# Altium schematic sheet AMC_BOX_Panel.SchDoc
size A3 portrait
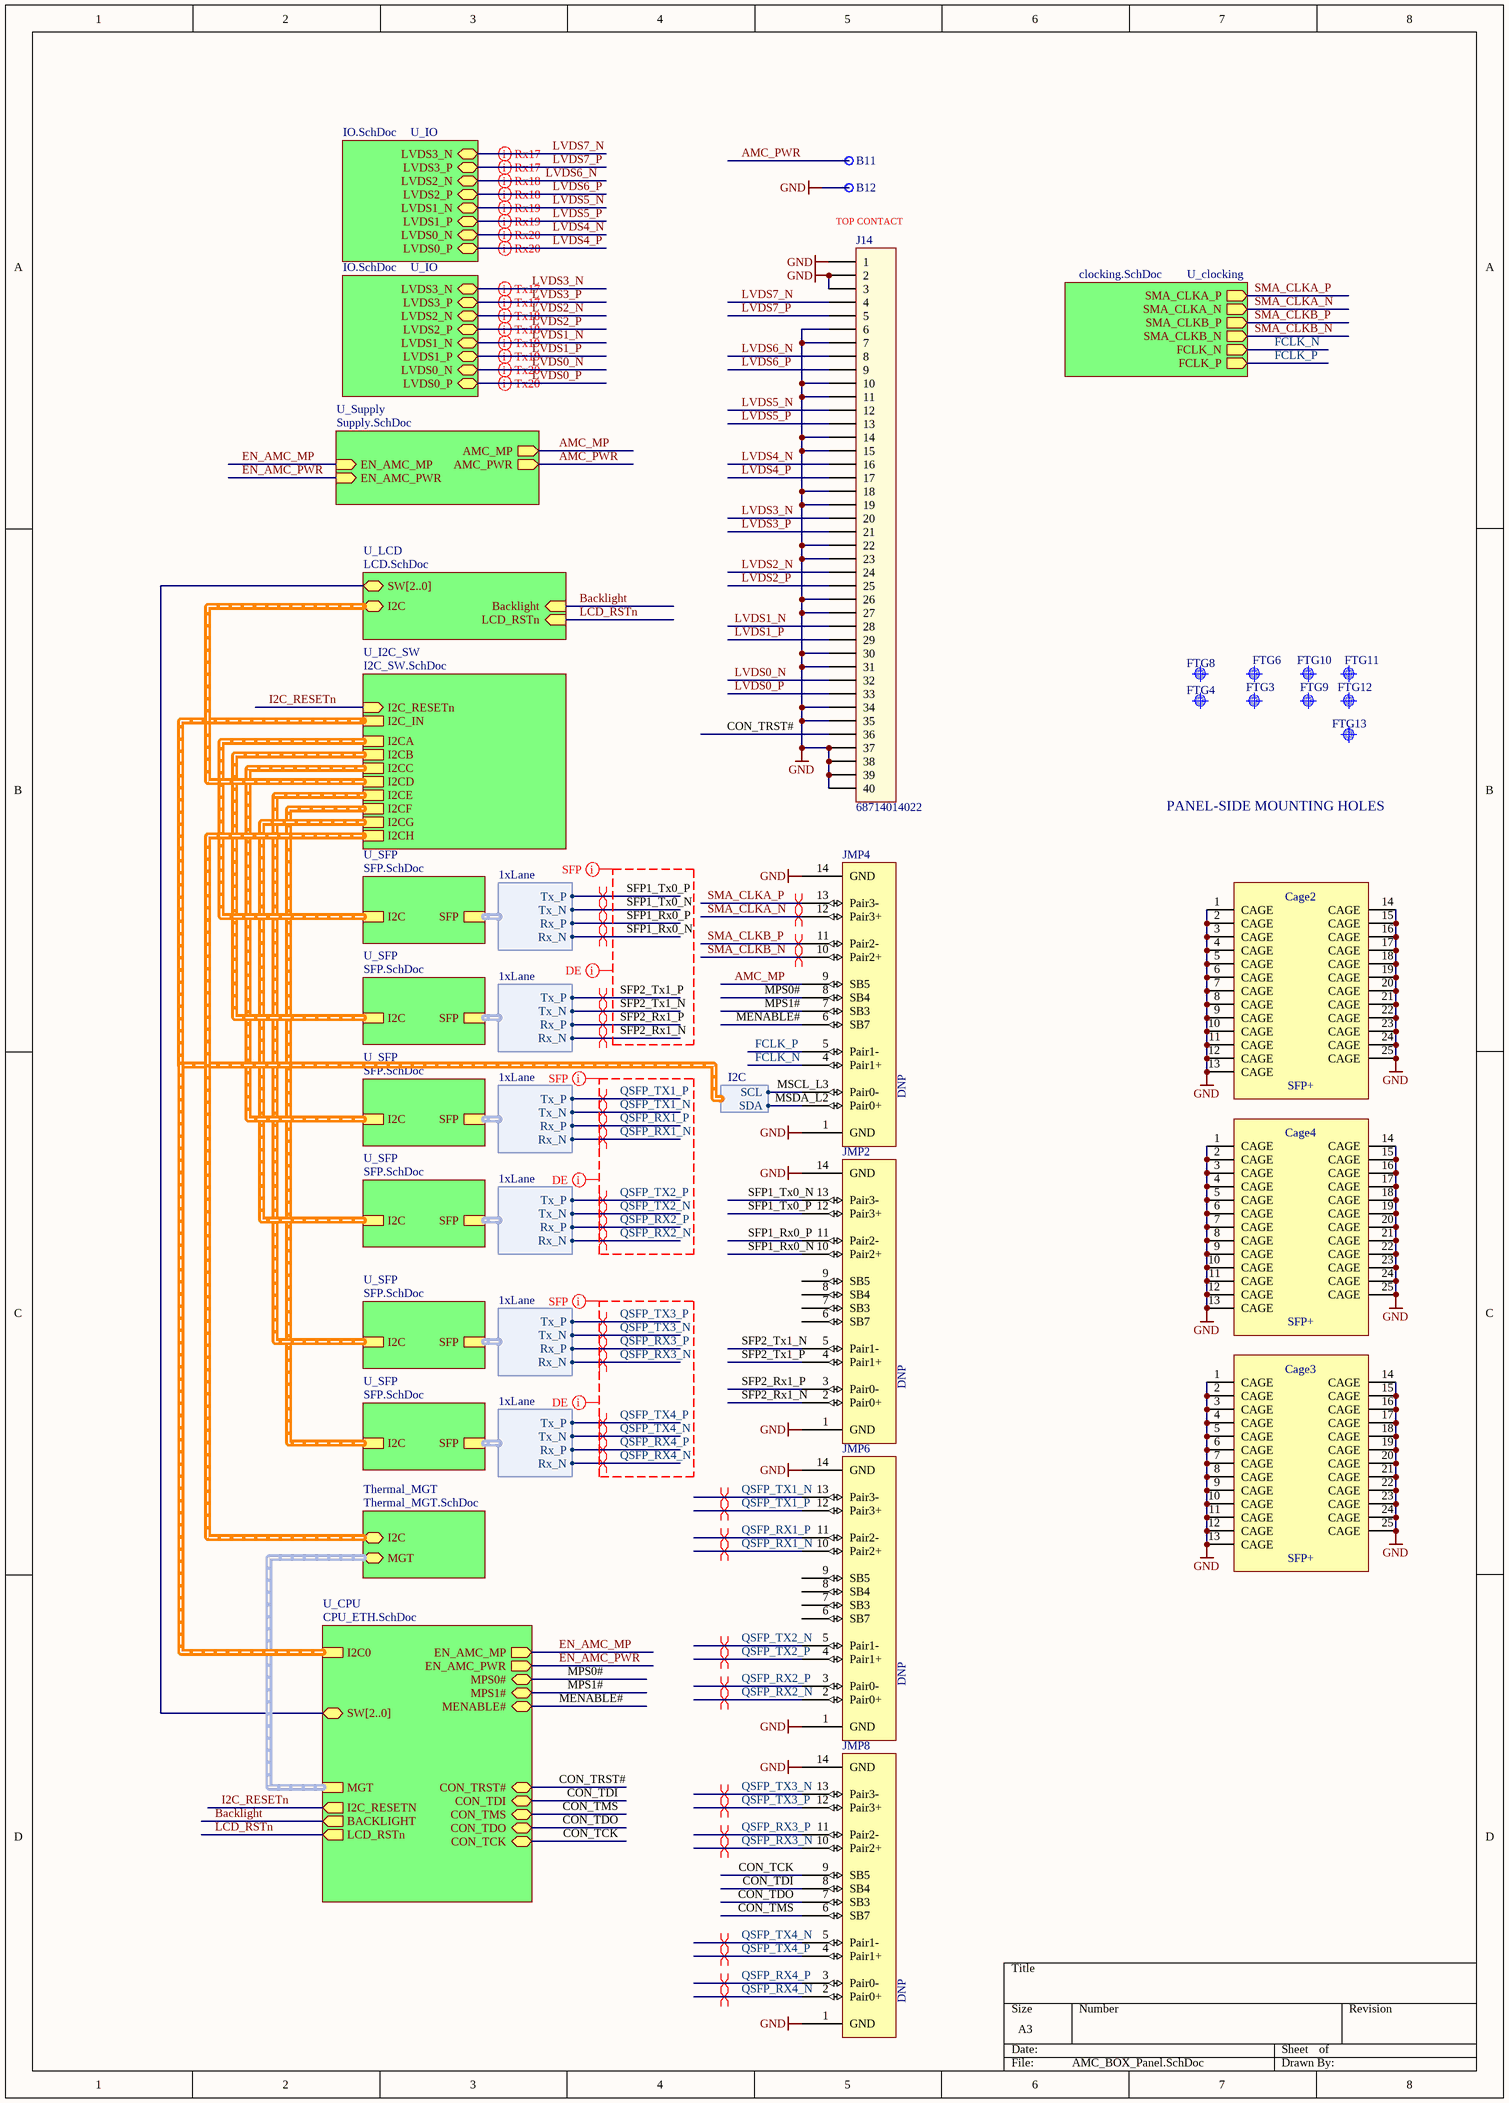
[diagram p0: AMC_BOX_Panel.SchDoc]

## Parts
B11  Plated Hole  [c200h150]  (value not drawn)
B12  Plated Hole  [c200h150]  (value not drawn)
Cage2  SFP+  [TYCO_2007263-1]
Cage3  SFP+  [TYCO_2007263-1]
Cage4  SFP+  [TYCO_2007263-1]
FTG3  Use only in PCB  [FIDUCIAL_TOP_S100-200]  (value not drawn)
FTG4  Use only in PCB  [FIDUCIAL_TOP_S100-200]  (value not drawn)
FTG6  Use only in PCB  [FIDUCIAL_TOP_S100-200]  (value not drawn)
FTG8  Use only in PCB  [FIDUCIAL_TOP_S100-200]  (value not drawn)
FTG9  Use only in PCB  [FIDUCIAL_TOP_S100-200]  (value not drawn)
FTG10  Use only in PCB  [FIDUCIAL_TOP_S100-200]  (value not drawn)
FTG11  Use only in PCB  [FIDUCIAL_TOP_S100-200]  (value not drawn)
FTG12  Use only in PCB  [FIDUCIAL_TOP_S100-200]  (value not drawn)
FTG13  Use only in PCB  [FIDUCIAL_TOP_S100-200]  (value not drawn)
J14  68714014022  [68714014022]
JMP2  DNP  [3M_Twinax_SL8801/12-10DA5-00]
JMP4  DNP  [3M_Twinax_SL8801/12-10DA5-00]
JMP6  DNP  [3M_Twinax_SL8801/12-10DA5-00]
JMP8  DNP  [3M_Twinax_SL8801/12-10DA5-00]

## Sub-sheets
Thermal_MGT = Thermal_MGT.SchDoc: I2C (harness I2C), MGT (harness THERM_MGT)
U_clocking = clocking.SchDoc: SMA_CLKA_P (out), SMA_CLKA_N (out), SMA_CLKB_P (out), SMA_CLKB_N (out), FCLK_N (out), FCLK_P (out)
U_CPU = CPU_ETH.SchDoc: I2C0 (harness I2C), MGT (harness THERM_MGT), EN_AMC_MP (out), EN_AMC_PWR (out), MPS0# (bidir), MPS1# (bidir), MENABLE# (bidir), CON_TRST#, CON_TDI (bidir), CON_TMS (bidir), CON_TDO (bidir), CON_TCK (bidir), SW[2..0] (bidir), BACKLIGHT (out), LCD_RSTn (out), I2C_RESETN (out)
U_I2C_SW = I2C_SW.SchDoc: I2C_RESETn (in), I2CE (harness I2C), I2CB (harness I2C), I2CA (harness I2C), I2CD (harness I2C), I2CC (harness I2C), I2CG (harness I2C), I2CF (harness I2C), I2CH (harness I2C), I2C_IN (harness I2C)
U_IO = IO.SchDoc: LVDS3_N (bidir), LVDS3_P (bidir), LVDS2_N (bidir), LVDS2_P (bidir), LVDS1_N (bidir), LVDS1_P (bidir), LVDS0_N (bidir), LVDS0_P (bidir)
U_IO = IO.SchDoc: LVDS3_N (bidir), LVDS3_P (bidir), LVDS2_N (bidir), LVDS2_P (bidir), LVDS1_N (bidir), LVDS1_P (bidir), LVDS0_N (bidir), LVDS0_P (bidir)
U_LCD = LCD.SchDoc: I2C, Backlight (in), LCD_RSTn (in), SW[2..0] (bidir)
U_SFP = SFP.SchDoc: I2C (harness I2C), SFP (harness 1xLane)
U_SFP = SFP.SchDoc: I2C (harness I2C), SFP (harness 1xLane)
U_SFP = SFP.SchDoc: I2C (harness I2C), SFP (harness 1xLane)
U_SFP = SFP.SchDoc: I2C (harness I2C), SFP (harness 1xLane)
U_SFP = SFP.SchDoc: I2C (harness I2C), SFP (harness 1xLane)
U_SFP = SFP.SchDoc: I2C (harness I2C), SFP (harness 1xLane)
U_Supply = Supply.SchDoc: AMC_PWR (out), AMC_MP (out), EN_AMC_MP (in), EN_AMC_PWR (in)

## Harnesses
1xLane: Rx_P, Rx_N, Tx_P, Tx_N
I2C: SCL, SDA

## Nets
GND: B12.1 Cage2.1(CAGE) Cage2.2(CAGE) Cage2.3(CAGE) Cage2.4(CAGE) Cage2.5(CAGE) Cage2.6(CAGE) Cage2.7(CAGE) Cage2.8(CAGE) Cage2.9(CAGE) Cage2.10(CAGE) Cage2.11(CAGE) Cage2.12(CAGE) Cage2.13(CAGE) Cage2.14(CAGE) Cage2.15(CAGE) Cage2.16(CAGE) Cage2.17(CAGE) Cage2.18(CAGE) Cage2.19(CAGE) Cage2.20(CAGE) Cage2.21(CAGE) Cage2.22(CAGE) Cage2.23(CAGE) Cage2.24(CAGE) Cage2.25(CAGE) Cage3.1(CAGE) Cage3.2(CAGE) Cage3.3(CAGE) Cage3.4(CAGE) Cage3.5(CAGE) Cage3.6(CAGE) Cage3.7(CAGE) Cage3.8(CAGE) Cage3.9(CAGE) Cage3.10(CAGE) Cage3.11(CAGE) Cage3.12(CAGE) Cage3.13(CAGE) Cage3.14(CAGE) Cage3.15(CAGE) Cage3.16(CAGE) Cage3.17(CAGE) Cage3.18(CAGE) Cage3.19(CAGE) Cage3.20(CAGE) Cage3.21(CAGE) Cage3.22(CAGE) Cage3.23(CAGE) Cage3.24(CAGE) Cage3.25(CAGE) Cage4.1(CAGE) Cage4.2(CAGE) Cage4.3(CAGE) Cage4.4(CAGE) Cage4.5(CAGE) Cage4.6(CAGE) Cage4.7(CAGE) Cage4.8(CAGE) Cage4.9(CAGE) Cage4.10(CAGE) Cage4.11(CAGE) Cage4.12(CAGE) Cage4.13(CAGE) Cage4.14(CAGE) Cage4.15(CAGE) Cage4.16(CAGE) Cage4.17(CAGE) Cage4.18(CAGE) Cage4.19(CAGE) Cage4.20(CAGE) Cage4.21(CAGE) Cage4.22(CAGE) Cage4.23(CAGE) Cage4.24(CAGE) Cage4.25(CAGE) J14.1 J14.2 J14.3 J14.6 J14.7 J14.10 J14.11 J14.14 J14.15 J14.18 J14.19 J14.22 J14.23 J14.26 J14.27 J14.30 J14.31 J14.34 J14.35 J14.37 J14.38 J14.39 J14.40 JMP2.1(GND) JMP2.14(GND) JMP4.1(GND) JMP4.14(GND) JMP6.1(GND) JMP6.14(GND) JMP8.1(GND) JMP8.14(GND)
AMC_MP: JMP4.9(SB5) ; sheet U_Supply/AMC_MP
AMC_PWR: B11.1 ; sheet U_Supply/AMC_PWR
Backlight: sheet U_CPU/BACKLIGHT, sheet U_LCD/Backlight
CON_TCK: JMP8.9(SB5) ; sheet U_CPU/CON_TCK
CON_TDI: JMP8.8(SB4) ; sheet U_CPU/CON_TDI
CON_TDO: JMP8.7(SB3) ; sheet U_CPU/CON_TDO
CON_TMS: JMP8.6(SB7) ; sheet U_CPU/CON_TMS
CON_TRST#: J14.36 ; sheet U_CPU/CON_TRST#
EN_AMC_MP: sheet U_Supply/EN_AMC_MP, sheet U_CPU/EN_AMC_MP
EN_AMC_PWR: sheet U_Supply/EN_AMC_PWR, sheet U_CPU/EN_AMC_PWR
FCLK_N: JMP4.4(Pair1+) ; sheet U_clocking/FCLK_N
FCLK_P: JMP4.5(Pair1-) ; sheet U_clocking/FCLK_P
I2C_RESETn: sheet U_I2C_SW/I2C_RESETn, sheet U_CPU/I2C_RESETN
LCD_RSTn: sheet U_CPU/LCD_RSTn, sheet U_LCD/LCD_RSTn
LVDS0_N: J14.32 ; sheet U_IO/LVDS0_N
LVDS0_P: J14.33 ; sheet U_IO/LVDS0_P
LVDS1_N: J14.28 ; sheet U_IO/LVDS1_N
LVDS1_P: J14.29 ; sheet U_IO/LVDS1_P
LVDS2_N: J14.24 ; sheet U_IO/LVDS2_N
LVDS2_P: J14.25 ; sheet U_IO/LVDS2_P
LVDS3_N: J14.20 ; sheet U_IO/LVDS3_N
LVDS3_P: J14.21 ; sheet U_IO/LVDS3_P
LVDS4_N: J14.16 ; sheet U_IO/LVDS0_N
LVDS4_P: J14.17 ; sheet U_IO/LVDS0_P
LVDS5_N: J14.12 ; sheet U_IO/LVDS1_N
LVDS5_P: J14.13 ; sheet U_IO/LVDS1_P
LVDS6_N: J14.8 ; sheet U_IO/LVDS2_N
LVDS6_P: J14.9 ; sheet U_IO/LVDS2_P
LVDS7_N: J14.4 ; sheet U_IO/LVDS3_N
LVDS7_P: J14.5 ; sheet U_IO/LVDS3_P
MENABLE#: JMP4.6(SB7) ; sheet U_CPU/MENABLE#
MPS0#: JMP4.8(SB4) ; sheet U_CPU/MPS0#
MPS1#: JMP4.7(SB3) ; sheet U_CPU/MPS1#
MSCL_L: JMP4.3(Pair0-) ; sheet U_I2C_SW/I2C_IN.SCL
MSDA_L: JMP4.2(Pair0+) ; sheet U_I2C_SW/I2C_IN.SDA
QSFP_RX1_N: JMP6.10(Pair2+) ; sheet U_SFP/SFP.Rx_N
QSFP_RX1_P: JMP6.11(Pair2-) ; sheet U_SFP/SFP.Rx_P
QSFP_RX2_N: JMP6.2(Pair0+) ; sheet U_SFP/SFP.Rx_N
QSFP_RX2_P: JMP6.3(Pair0-) ; sheet U_SFP/SFP.Rx_P
QSFP_RX3_N: JMP8.10(Pair2+) ; sheet U_SFP/SFP.Rx_N
QSFP_RX3_P: JMP8.11(Pair2-) ; sheet U_SFP/SFP.Rx_P
QSFP_RX4_N: JMP8.2(Pair0+) ; sheet U_SFP/SFP.Rx_N
QSFP_RX4_P: JMP8.3(Pair0-) ; sheet U_SFP/SFP.Rx_P
QSFP_TX1_N: JMP6.13(Pair3-) ; sheet U_SFP/SFP.Tx_N
QSFP_TX1_P: JMP6.12(Pair3+) ; sheet U_SFP/SFP.Tx_P
QSFP_TX2_N: JMP6.5(Pair1-) ; sheet U_SFP/SFP.Tx_N
QSFP_TX2_P: JMP6.4(Pair1+) ; sheet U_SFP/SFP.Tx_P
QSFP_TX3_N: JMP8.13(Pair3-) ; sheet U_SFP/SFP.Tx_N
QSFP_TX3_P: JMP8.12(Pair3+) ; sheet U_SFP/SFP.Tx_P
QSFP_TX4_N: JMP8.5(Pair1-) ; sheet U_SFP/SFP.Tx_N
QSFP_TX4_P: JMP8.4(Pair1+) ; sheet U_SFP/SFP.Tx_P
SFP1_Rx0_N: JMP2.10(Pair2+) ; sheet U_SFP/SFP.Rx_N
SFP1_Rx0_P: JMP2.11(Pair2-) ; sheet U_SFP/SFP.Rx_P
SFP1_Tx0_N: JMP2.13(Pair3-) ; sheet U_SFP/SFP.Tx_N
SFP1_Tx0_P: JMP2.12(Pair3+) ; sheet U_SFP/SFP.Tx_P
SFP2_Rx1_N: JMP2.2(Pair0+) ; sheet U_SFP/SFP.Rx_N
SFP2_Rx1_P: JMP2.3(Pair0-) ; sheet U_SFP/SFP.Rx_P
SFP2_Tx1_N: JMP2.5(Pair1-) ; sheet U_SFP/SFP.Tx_N
SFP2_Tx1_P: JMP2.4(Pair1+) ; sheet U_SFP/SFP.Tx_P
SMA_CLKA_N: JMP4.12(Pair3+) ; sheet U_clocking/SMA_CLKA_N
SMA_CLKA_P: JMP4.13(Pair3-) ; sheet U_clocking/SMA_CLKA_P
SMA_CLKB_N: JMP4.10(Pair2+) ; sheet U_clocking/SMA_CLKB_N
SMA_CLKB_P: JMP4.11(Pair2-) ; sheet U_clocking/SMA_CLKB_P

Not connected (* = marked no-connect by the designer): JMP2 6(SB7) 7(SB3) 8(SB4) 9(SB5); JMP6 6(SB7) 7(SB3) 8(SB4) 9(SB5)

## Buses and harness runs
bus sheet U_CPU/SW[2..0] = sheet U_LCD/SW[2..0]
harness sheet Thermal_MGT/I2C = sheet U_I2C_SW/I2CH
harness sheet Thermal_MGT/MGT = sheet U_CPU/MGT
harness sheet U_CPU/I2C0 = sheet U_I2C_SW/I2C_IN
harness sheet U_I2C_SW/I2CA = sheet U_SFP/I2C
harness sheet U_I2C_SW/I2CB = sheet U_SFP/I2C
harness sheet U_I2C_SW/I2CC = sheet U_SFP/I2C
harness sheet U_I2C_SW/I2CD = sheet U_LCD/I2C
harness sheet U_I2C_SW/I2CE = sheet U_SFP/I2C
harness sheet U_I2C_SW/I2CF = sheet U_SFP/I2C
harness sheet U_I2C_SW/I2CG = sheet U_SFP/I2C

## Layout directives
differential pair: LVDS0_N, LVDS0_P, LVDS1_N, LVDS1_P, LVDS2_N, LVDS2_P, LVDS3_N, LVDS3_P, LVDS4_N, LVDS4_P, LVDS5_N, LVDS5_P, LVDS6_N, LVDS6_P, LVDS7_N, LVDS7_P, QSFP_RX1_N, QSFP_RX1_P, QSFP_RX2_N, QSFP_RX2_P, QSFP_RX3_N, QSFP_RX3_P, QSFP_RX4_N, QSFP_RX4_P, QSFP_TX1_N, QSFP_TX1_P, QSFP_TX2_N, QSFP_TX2_P, QSFP_TX3_N, QSFP_TX3_P, QSFP_TX4_N, QSFP_TX4_P, SFP1_Rx0_N, SFP1_Rx0_P, SFP1_Tx0_N, SFP1_Tx0_P, SFP2_Rx1_N, SFP2_Rx1_P, SFP2_Tx1_N, SFP2_Tx1_P, SMA_CLKA_N, SMA_CLKA_P, SMA_CLKB_N, SMA_CLKB_P
net class SFP: QSFP_RX1_N, QSFP_RX1_P, QSFP_RX2_N, QSFP_RX2_P, QSFP_RX3_N, QSFP_RX3_P, QSFP_RX4_N, QSFP_RX4_P, QSFP_TX1_N, QSFP_TX1_P, QSFP_TX2_N, QSFP_TX2_P, QSFP_TX3_N, QSFP_TX3_P, QSFP_TX4_N, QSFP_TX4_P, SFP1_Rx0_N, SFP1_Rx0_P, SFP1_Tx0_N, SFP1_Tx0_P, SFP2_Rx1_N, SFP2_Rx1_P, SFP2_Tx1_N, SFP2_Tx1_P
net class DE: QSFP_RX1_N, QSFP_RX1_P, QSFP_RX2_N, QSFP_RX2_P, QSFP_RX3_N, QSFP_RX3_P, QSFP_RX4_N, QSFP_RX4_P, QSFP_TX1_N, QSFP_TX1_P, QSFP_TX2_N, QSFP_TX2_P, QSFP_TX3_N, QSFP_TX3_P, QSFP_TX4_N, QSFP_TX4_P, SFP1_Rx0_N, SFP1_Rx0_P, SFP1_Tx0_N, SFP1_Tx0_P, SFP2_Rx1_N, SFP2_Rx1_P, SFP2_Tx1_N, SFP2_Tx1_P

## Notes on the sheet
- TOP CONTACT
- PANEL-SIDE MOUNTING HOLES

## Library data of the parts
B11 B12 = PLATED_HOLE1.5_PAD2.0: Single Terminal Socket; Part Description: Plated Through Hole: Hole Dia.=1.5mm Pad Dia.=2.0mm, IPC-7251 Level C; Mounted: No; Part Number: PLATED_HOLE1.5_PAD2.0; Component Kind: Standard (No BOM); Component Type: Standard (No BOM); Pin Count: 1; Family: Plated Hole; Socket: No; SMD: No; Sense: No; Status: None; ComponentHeight: 0mm; HelpURL: Undefined; Author: CERN DEM JLC; CreateDate: 30.10.2008; LatestRevisionDate: 30.10.2008; PackageDescription: Plated Through Hole: Hole Dia.=1.5mm Pad Dia.=2.0mm, IPC-7251 Level C
Cage2-Cage4 = TYCO_2007263-1: SFP 1x2 Cage (25Pins); Part Description: 1x2 Press Fit SFP+ Cage with EMI Springs; Manufacturer: TYCO ELECTRONICS; Part Number: TYCO_2007263-1; Component Kind: Standard; Component Type: Standard; Pin Count: 25; Family: SFP+; Mounted: Yes; Socket: No; SMD: No; PressFit: Yes; Sense: No; Status: None; Manufacturer Part Number: 2007263-1; ComponentHeight: 9.7mm; HelpURL: \\cern.ch\dfs\Applications\Altium\Datasheets\TYCO_2007263-1.pdf; Author: CERN DEM JLC; CreateDate: 18.01.2017; LatestRevisionDate: 18.01.2017
FTG3 FTG4 FTG6 FTG8-FTG13 = FIDUCIAL_TARGET_S100-200: Fiducial Target; Part Description: Square Fiducial Target, Top Layer, 1.0mm, Top Solder 2.0mm, Keepout =2.0mm; Mounted: No; Table: Pads; Part Number: FIDUCIAL_TARGET_S100-200; Component Kind: Standard (No BOM); Component Type: Standard (No BOM); Pin Count: 1; Family: Fiducial; Socket: No; SMD: Yes; Status: None; ComponentHeight: 0mm; Author: CERN DEM JLC; CreateDate: 2010-02-09; LatestRevisionDate: 2012-04-04; PackageDescription: Square Fiducial Target, Top Layer, 1.0mm, Top Solder 2.0mm, Keepout =2.0mm
J14 = 68714014022: 0.50 mm SMT ZIF Horizontal Top Contact WR-FPC, 40 pins; Pitch: 0.5 mm; Pin Number: 40; ComponentLink1Description: Manufacturer; ComponentLink1URL: http://www.we-online.de; ComponentLink2Description: Datasheet; ComponentLink2URL: http://katalog.we-online.com/em/datasheet/6871xx14022.pdf; Part Number: 68714014022; Published Date: April 2017; Publisher: Wurth Elektronik
JMP2 JMP4 JMP6 JMP8 = CBL_TWINAX_3M_4pairs_SB: Flat Ribbon Cable Silver 8 (4 Pair) Conductors 0.093" (2.37mm) Between Pairs Flat Twin Axial 500.0' (152.40m)